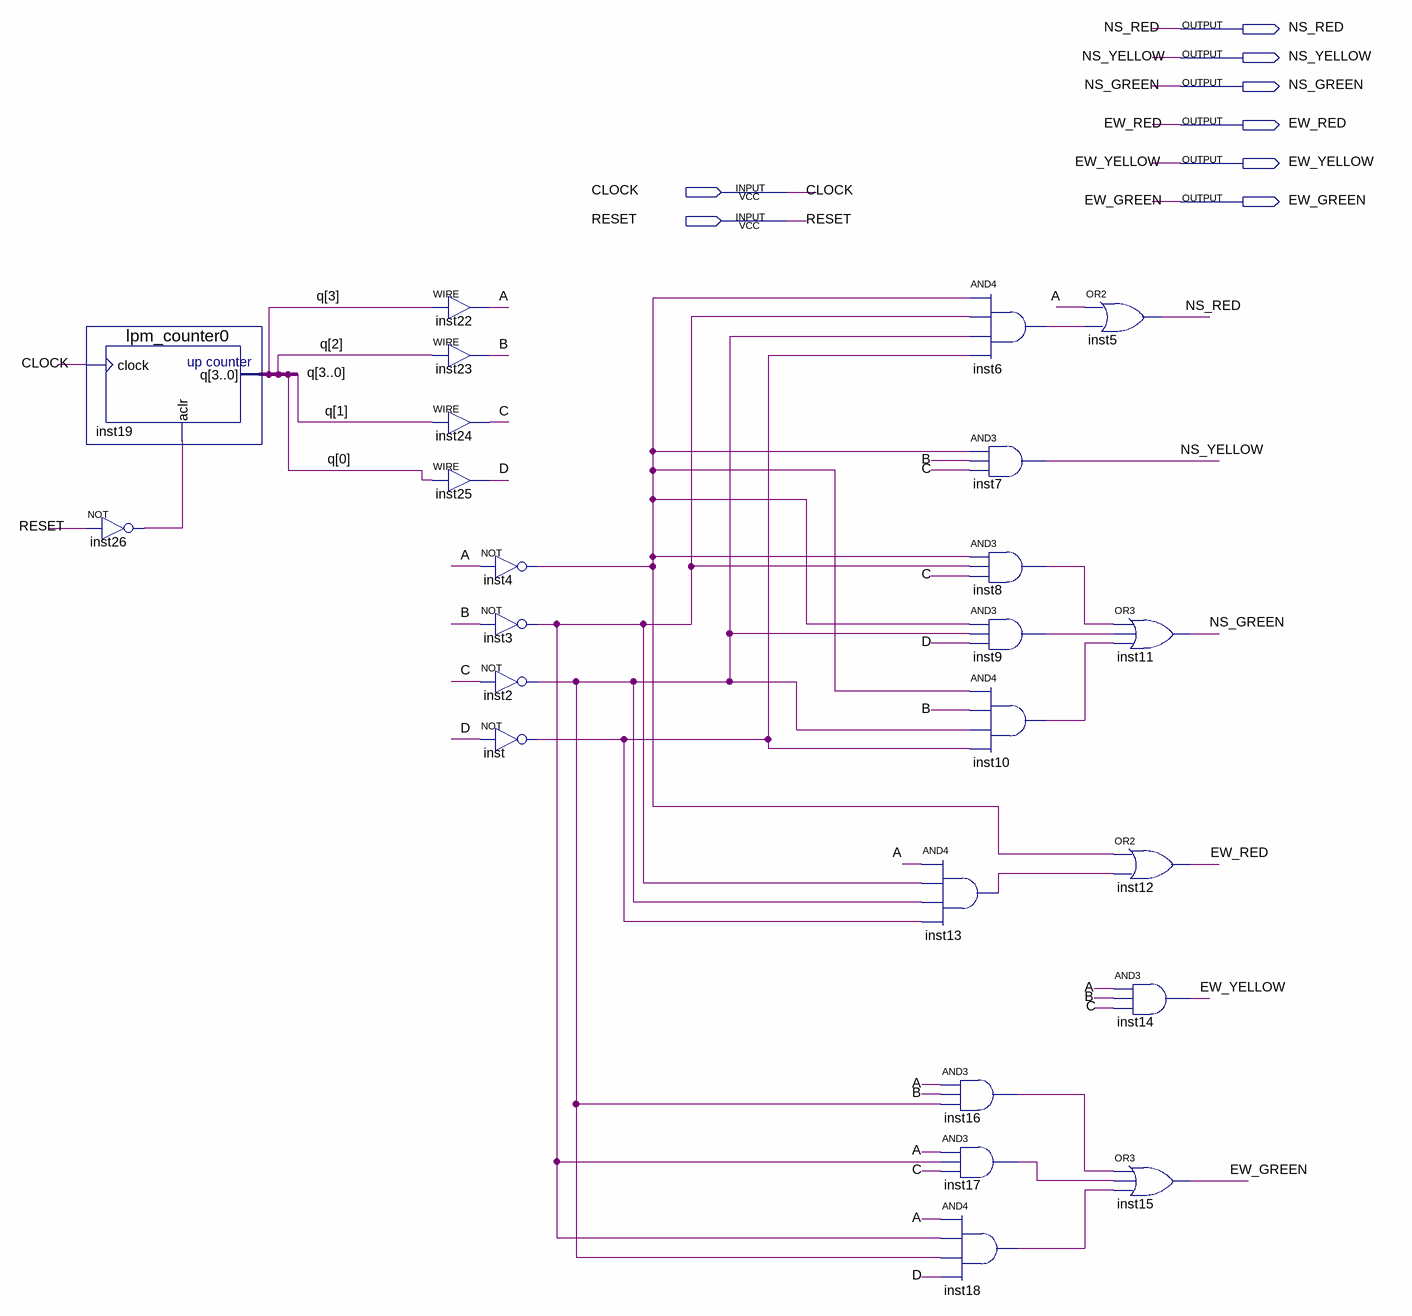
[diagram p0: schematic sheet]
// Quartus schematic traffic.bdf as structural Verilog: 24 symbols, 8 pins
module traffic (
  input  CLOCK,
  input  RESET,
  output NS_RED,
  output NS_YELLOW,
  output NS_GREEN,
  output EW_RED,
  output EW_YELLOW,
  output EW_GREEN
);

  wire A, B, C, D, inst2_out, inst3_out, inst4_out, inst6_out, inst8_out, inst9_out, inst10_out, inst13_out,
       inst16_out, inst17_out, inst18_out, inst26_out, inst_out;
  wire [3:0] q;

  lpm_counter0 inst19 (.clock(CLOCK), .aclr(inst26_out), .q(q));
  not inst26 (inst26_out, RESET);
  assign A = q[3];  // WIRE inst22
  assign B = q[2];  // WIRE inst23
  assign C = q[1];  // WIRE inst24
  assign D = q[0];  // WIRE inst25
  not inst4 (inst4_out, A);
  not inst3 (inst3_out, B);
  not inst2 (inst2_out, C);
  not inst (inst_out, D);
  and inst13 (inst13_out, A, inst3_out, inst2_out, inst_out);
  and inst16 (inst16_out, A, B, inst2_out);
  and inst17 (inst17_out, A, inst3_out, C);
  and inst18 (inst18_out, A, inst3_out, inst2_out, D);
  and inst6 (inst6_out, inst4_out, inst3_out, inst2_out, inst_out);
  and inst7 (NS_YELLOW, inst4_out, B, C);
  and inst8 (inst8_out, inst4_out, inst3_out, C);
  and inst9 (inst9_out, inst4_out, inst2_out, D);
  and inst10 (inst10_out, inst4_out, B, inst2_out, inst_out);
  or inst5 (NS_RED, A, inst6_out);
  or inst11 (NS_GREEN, inst8_out, inst9_out, inst10_out);
  or inst12 (EW_RED, inst4_out, inst13_out);
  and inst14 (EW_YELLOW, A, B, C);
  or inst15 (EW_GREEN, inst16_out, inst17_out, inst18_out);
endmodule
